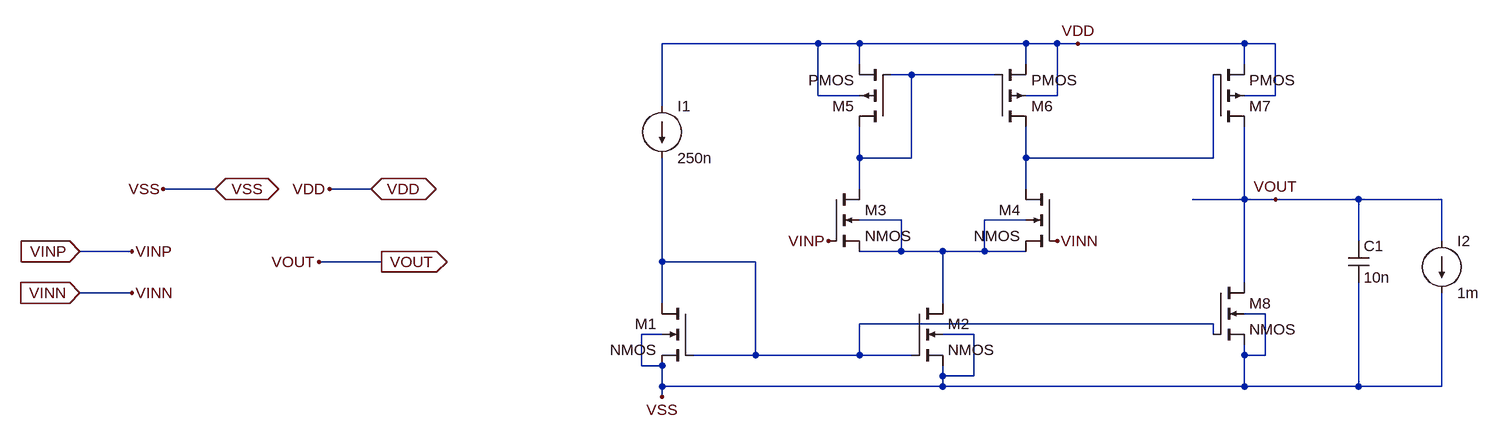
[diagram p0: schematic myAmp.asc]
myAmp.asc, the LTspice schematic file:
Version 4
SHEET 1 1444 680
WIRE 400 -592 160 -592
WIRE 464 -592 400 -592
WIRE 720 -592 464 -592
WIRE 768 -592 720 -592
WIRE 800 -592 768 -592
WIRE 1056 -592 800 -592
WIRE 1104 -592 1056 -592
WIRE 464 -560 464 -592
WIRE 720 -560 720 -592
WIRE 1056 -560 1056 -592
WIRE 544 -544 512 -544
WIRE 672 -544 544 -544
WIRE 400 -512 400 -592
WIRE 464 -512 400 -512
WIRE 768 -512 768 -592
WIRE 768 -512 720 -512
WIRE 1104 -512 1104 -592
WIRE 1104 -512 1056 -512
WIRE 160 -496 160 -592
WIRE 464 -416 464 -464
WIRE 544 -416 544 -544
WIRE 544 -416 464 -416
WIRE 720 -416 720 -464
WIRE 1008 -416 1008 -544
WIRE 1008 -416 720 -416
WIRE -528 -368 -608 -368
WIRE -288 -368 -352 -368
WIRE 464 -368 464 -416
WIRE 720 -368 720 -416
WIRE 1056 -352 1056 -464
WIRE 1056 -352 976 -352
WIRE 1104 -352 1056 -352
WIRE 1232 -352 1104 -352
WIRE 1360 -352 1232 -352
WIRE 528 -320 464 -320
WIRE 720 -320 656 -320
WIRE 1232 -288 1232 -352
WIRE 1360 -288 1360 -352
WIRE -656 -272 -736 -272
WIRE 528 -272 528 -320
WIRE 528 -272 464 -272
WIRE 592 -272 528 -272
WIRE 656 -272 656 -320
WIRE 656 -272 592 -272
WIRE 720 -272 656 -272
WIRE -272 -256 -368 -256
WIRE 160 -256 160 -416
WIRE 304 -256 160 -256
WIRE 1056 -224 1056 -352
WIRE -656 -208 -736 -208
WIRE 160 -192 160 -256
WIRE 592 -192 592 -272
WIRE 1088 -176 1056 -176
WIRE 1008 -160 464 -160
WIRE 160 -144 128 -144
WIRE 640 -144 592 -144
WIRE 1008 -144 1008 -160
WIRE 304 -112 304 -256
WIRE 304 -112 208 -112
WIRE 464 -112 464 -160
WIRE 464 -112 304 -112
WIRE 544 -112 464 -112
WIRE 1056 -112 1056 -128
WIRE 1088 -112 1088 -176
WIRE 1088 -112 1056 -112
WIRE 128 -96 128 -144
WIRE 160 -96 128 -96
WIRE 592 -80 592 -96
WIRE 640 -80 640 -144
WIRE 640 -80 592 -80
WIRE 160 -64 160 -96
WIRE 592 -64 592 -80
WIRE 592 -64 160 -64
WIRE 1056 -64 1056 -112
WIRE 1056 -64 592 -64
WIRE 1232 -64 1232 -224
WIRE 1232 -64 1056 -64
WIRE 1360 -64 1360 -208
WIRE 1360 -64 1232 -64
WIRE 160 -48 160 -64
FLAG -736 -272 VINP
IOPIN -736 -272 In
FLAG -272 -256 VOUT
IOPIN -272 -256 Out
FLAG -736 -208 VINN
IOPIN -736 -208 In
FLAG -288 -368 VDD
IOPIN -288 -368 BiDir
FLAG -528 -368 VSS
IOPIN -528 -368 BiDir
FLAG -656 -208 VINN
FLAG -656 -272 VINP
FLAG -368 -256 VOUT
FLAG -352 -368 VDD
FLAG -608 -368 VSS
FLAG 160 -48 VSS
FLAG 416 -288 VINP
FLAG 768 -288 VINN
FLAG 800 -592 VDD
FLAG 1104 -352 VOUT
SYMBOL current 160 -496 R0
SYMATTR InstName I1
SYMATTR Value 250n
SYMBOL nmos4 208 -192 M0
SYMATTR InstName M1
SYMATTR Value2 l=1.260u w=.360u
SYMBOL nmos4 544 -192 R0
SYMATTR InstName M2
SYMATTR Value2 l=1.260u w=.360u
SYMBOL nmos4 416 -368 R0
SYMATTR InstName M3
SYMATTR Value2 l=.360u w=.360u
SYMBOL nmos4 768 -368 M0
SYMATTR InstName M4
SYMATTR Value2 l=.360u w=.360u
SYMBOL pmos4 512 -464 R180
SYMATTR InstName M5
SYMATTR Value2 l=.720u w=.360u
SYMBOL pmos4 672 -464 M180
SYMATTR InstName M6
SYMATTR Value2 l=.720u w=.360u
SYMBOL nmos4 1008 -224 R0
SYMATTR InstName M8
SYMATTR Value2 l=1.260u w=.360u
SYMBOL cap 1216 -288 R0
SYMATTR InstName C1
SYMATTR Value 10n
SYMBOL pmos4 1008 -464 M180
SYMATTR InstName M7
SYMATTR Value2 l=.180u w=.1000u
SYMBOL current 1360 -288 R0
SYMATTR InstName I2
SYMATTR Value 1m

The netlist it stands for:
* myAmp.asc
I1 VDD N004 250n
M1 N004 N004 VSS VSS NMOS l=1.260u w=.360u
M2 N003 N004 VSS VSS NMOS l=1.260u w=.360u
M3 N001 VINP N003 N003 NMOS l=.360u w=.360u
M4 N002 VINN N003 N003 NMOS l=.360u w=.360u
M5 N001 N001 VDD VDD PMOS l=.720u w=.360u
M6 N002 N001 VDD VDD PMOS l=.720u w=.360u
M8 VOUT N004 VSS VSS NMOS l=1.260u w=.360u
C1 VOUT VSS 10n
M7 VOUT N002 VDD VDD PMOS l=.180u w=.1000u
I2 VOUT VSS 1m
.model NMOS NMOS
.model PMOS PMOS
.lib standard.mos
.backanno
.end